# EAGLE design sismin_LC (EAGLE 7.6.0)
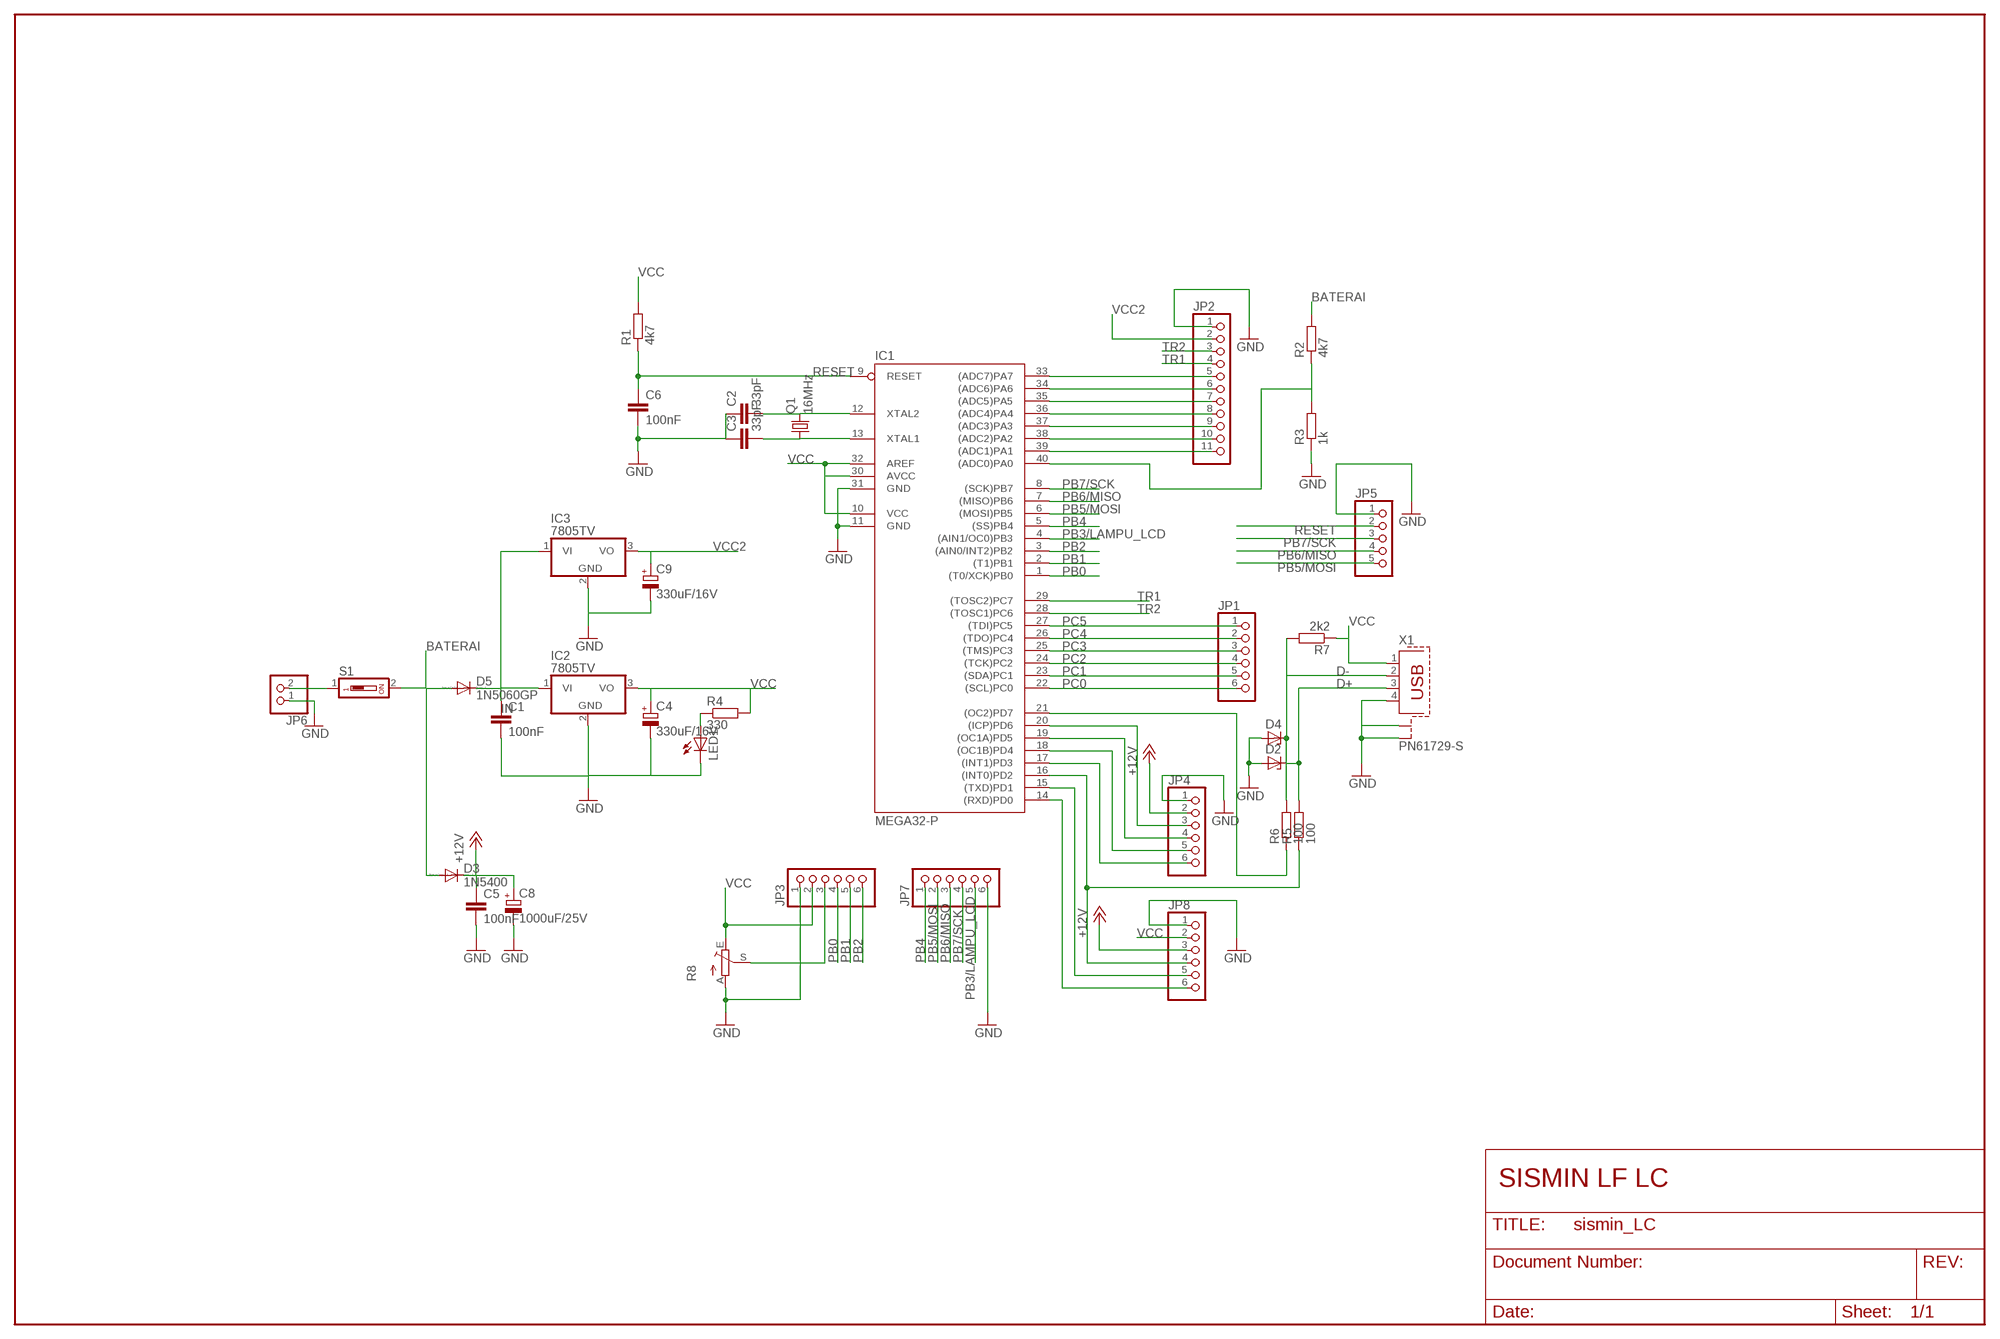
[diagram p0: schematic, sheet 1]

## Parts
C1  100nF  C-EU050-025X075  [C050-025X075]
C2  33pF  C-EU025-025X050  [C025-025X050]
C3  33pF  C-EU025-025X050  [C025-025X050]
C4  330uF/16V  CPOL-EUE2-5  [E2-5]
C5  100nF  C-EU050-025X075  [C050-025X075]
C6  100nF  C-EU050-025X075  [C050-025X075]
C8  1000uF/25V  CPOL-EUE2.5-6  [E2,5-6]
C9  330uF/16V  CPOL-EUE2-5  [E2-5]
D2  ZENER-DIODEDO41Z10  [DO41Z10]
D3  1N5400  [DO201-15]
D4  ZENER-DIODEDO41Z10  [DO41Z10]
D5  1N5060GP  [DO15-12]
IC1  MEGA32-P  [DIL40]
IC2  7805TV  [TO220V]
IC3  7805TV  [TO220V]
JP1  PINHD-1X6  [1X06]
JP2  PINHD-1X11  [1X11]
JP3  PINHD-1X6  [1X06]
JP4  PINHD-1X6  [1X06]
JP5  PINHD-1X5  [1X05]
JP6  PINHD-1X2  [1X02]
JP7  PINHD-1X6  [1X06]
JP8  PINHD-1X6  [1X06]
LED1  LED3MM  [LED3MM]
Q1  16MHz  CRYSTALHC49S  [HC49/S]
R1  4k7  R-EU_0204/7  [0204/7]
R2  4k7  R-EU_0204/7  [0204/7]
R3  1k  R-EU_0204/7  [0204/7]
R4  330  R-EU_0204/7  [0204/7]
R5  100  R-EU_0204/7  [0204/7]
R6  100  R-EU_0204/7  [0204/7]
R7  2k2  R-EU_0204/7  [0204/7]
R8  TRIM_EU-RS3  [RS3]
S1  DS01  [DS-01]
X1  PN61729-S  [PN61729-S]

## Nets
+12V: C5.1 C8.+ D3.C JP4.2 JP8.3
ADC1: IC1.39((ADC1)PA1) JP2.11
ADC2: IC1.38((ADC2)PA2) JP2.10
ADC3: IC1.37((ADC3)PA3) JP2.9
ADC4: IC1.36((ADC4)PA4) JP2.8
ADC5: IC1.35((ADC5)PA5) JP2.7
ADC6: IC1.34((ADC6)PA6) JP2.6
ADC7: IC1.33((ADC7)PA7) JP2.5
BATERAI: D3.A D5.A R2.2 S1.2
D+: D2.C R5.2 X1.3
D-: D4.C R6.2 R7.2 X1.2
GND: C1.2 C2.1 C3.1 C4.- C5.2 C6.2 C8.- C9.- D2.A D4.A IC1.11(GND) IC1.31(GND) IC2.2(GND) IC3.2(GND) JP2.1 JP3.1 JP4.1 JP5.1 JP6.1 JP7.6 JP8.1 LED1.K(C) R3.1 R8.A X1.4 X1.S1 X1.S2
IN: C1.1 D5.C IC2.1(VI) IC3.1(VI)
N$4: C2.2 IC1.12(XTAL2) Q1.2
N$5: C3.2 IC1.13(XTAL1) Q1.1
N$12: IC1.40((ADC0)PA0) R2.1 R3.2
N$13: JP6.2 S1.1
N$20: LED1.A R4.1
N$22: IC1.16((INT0)PD2) JP8.4 R5.1
N$23: IC1.20((ICP)PD6) JP4.3
N$24: IC1.19((OC1A)PD5) JP4.4
N$25: IC1.18((OC1B)PD4) JP4.5
N$26: IC1.17((INT1)PD3) JP4.6
N$32: JP3.3 R8.S
N$40: IC1.21((OC2)PD7) R6.1
PB0: IC1.1((T0/XCK)PB0) JP3.4
PB1: IC1.2((T1)PB1) JP3.5
PB2: IC1.3((AIN0/INT2)PB2) JP3.6
PB3/LAMPU_LCD: IC1.4((AIN1/OC0)PB3) JP7.5
PB4: IC1.5((SS)PB4) JP7.1
PB5/MOSI: IC1.6((MOSI)PB5) JP5.5 JP7.2
PB6/MISO: IC1.7((MISO)PB6) JP5.4 JP7.3
PB7/SCK: IC1.8((SCK)PB7) JP5.3 JP7.4
PC0: IC1.22((SCL)PC0) JP1.6
PC1: IC1.23((SDA)PC1) JP1.5
PC2: IC1.24((TCK)PC2) JP1.4
PC3: IC1.25((TMS)PC3) JP1.3
PC4: IC1.26((TDO)PC4) JP1.2
PC5: IC1.27((TDI)PC5) JP1.1
RESET: C6.1 IC1.9(RESET) JP5.2 R1.1
RX: IC1.14((RXD)PD0) JP8.6
TR1: IC1.29((TOSC2)PC7) JP2.4
TR2: IC1.28((TOSC1)PC6) JP2.3
TX: IC1.15((TXD)PD1) JP8.5
VCC: C4.+ IC1.10(VCC) IC1.30(AVCC) IC1.32(AREF) IC2.3(VO) JP3.2 JP8.2 R1.2 R4.2 R7.1 R8.E X1.1
VCC2: C9.+ IC3.3(VO) JP2.2

## Notes on the sheet
- SISMIN LF LC

## Library data of the parts
C1-C3 C5 C6 = resistor:C-EU: CAPACITOR, European symbol
C4 C8 C9 = resistor:CPOL-EU: POLARIZED CAPACITOR, European symbol
D2 D4 = diode:ZENER-DIODE: Z-Diode
D3 = diode:1N5400: DIODE standard rectifier, 3 A, 50 V (Motorola)
D5 = diode:1N5060GP: DIODE controlled avalanche rectifier
IC1 = atmel:MEGA32-P: MICROCONTROLLER 32 Kbytes FLASH 2 Kbytes SRAM 1 Kbytes EEPROM USART 8-channel 10 bit ADC Source: www.atmel.com .. doc2503.pdf; MPN: ATMEGA32-16PU; OC_FARNELL: 1661729; OC_NEWARK: 51P1794
IC2 IC3 = linear:78*: Positive VOLTAGE REGULATOR Source: http://cache.national.com/ds/LM/LM78L05.pdf http://www.fairchildsemi.com/ds/LM/LM7805.pdf
JP1 JP3 JP4 JP7 JP8 = pinhead:PINHD-1X6: PIN HEADER
JP2 = pinhead:PINHD-1X11: PIN HEADER
JP5 = pinhead:PINHD-1X5: PIN HEADER
JP6 = pinhead:PINHD-1X2: PIN HEADER
LED1 = led:LED: LED OSRAM: - CHIPLED LG R971, LG N971, LY N971, LG Q971, LY Q971, LO R971, LY R971 LH N974, LH R974 LS Q976, LO Q976, LY Q976 LO Q996 - Hyper CHIPLED LW Q18S LB Q993, LB Q99A, LB R99A - SideLED LS A670, LO A670, LY A670, LG A670, LP A670 LB A673, LV A673, LT A673, LW A673 LH A674 LY A675 LS A676, LA A676, LO A676, LY A676, LW A676 LS A679, LY A679, LG A679 - Hyper Micro SIDELED® LS Y876, LA Y876, LO Y876, LY Y876 LT Y87S - SmartLED LW L88C, LW L88S LB L89C, LB L89S, LG L890 LS L89K, LO L89K, LY L89K LS L896, LA L896, LO L896, LY L896 - TOPLED LS T670, LO T670, LY T670, LG T670, LP T670 LSG T670, LSP T670, LSY T670, LOP T670, LYG T670 LG T671, LOG T671, LSG T671 LB T673, LV T673, LT T673, LW T673 LH T674 LS T676, LA T676, LO T676, LY T676, LB T676, LH T676, LSB T676, LW T676 LB T67C, LV T67C, LT T67C, LS T67K, LO T67K, LY T67K, LW E67C LS E67B, LA E67B, LO E67B, LY E67B, LB E67C, LV E67C, LT E67C LW T67C LS T679, LY T679, LG T679 LS T770, LO T770, LY T770, LG T770, LP T770 LB T773, LV T773, LT T773, LW T773 LH T774 LS E675, LA E675, LY E675, LS T675 LS T776, LA T776, LO T776, LY T776, LB T776 LHGB T686 LT T68C, LB T68C - Hyper Mini TOPLED® LB M676 - Mini TOPLED Santana® LG M470 LS M47K, LO M47K, LY M47K Source: http://www.osram.convergy.de LUXEON: - LUMILED® LXK2-PW12-R00, LXK2-PW12-S00, LXK2-PW14-U00, LXK2-PW14-V00 LXK2-PM12-R00, LXK2-PM12-S00, LXK2-PM14-U00 LXK2-PE12-Q00, LXK2-PE12-R00, LXK2-PE12-S00, LXK2-PE14-T00, LXK2-PE14-U00 LXK2-PB12-K00, LXK2-PB12-L00, LXK2-PB12-M00, LXK2-PB14-N00, LXK2-PB14-P00, LXK2-PB14-Q00 LXK2-PR12-L00, LXK2-PR12-M00, LXK2-PR14-Q00, LXK2-PR14-R00 LXK2-PD12-Q00, LXK2-PD12-R00, LXK2-PD12-S00 LXK2-PH12-R00, LXK2-PH12-S00 LXK2-PL12-P00, LXK2-PL12-Q00, LXK2-PL12-R00 Source: www.luxeon.com KINGBRIGHT: KA-3528ASYC Source: www.kingbright.com
Q1 = crystal:CRYSTAL: CRYSTAL; OC_FARNELL: 1667008; OC_NEWARK: unknown
R1-R7 = resistor:R-EU_: RESISTOR, European symbol
R8 = pot:TRIM_EU-: POTENTIOMETER
S1 = switch-dil:DS01: DIL/CODE SWITCH; OC_FARNELL: unknown; OC_NEWARK: unknown
X1 = con-berg:PN61729-S: BERG USB connector; OC_FARNELL: unknown; OC_NEWARK: unknown

## Board
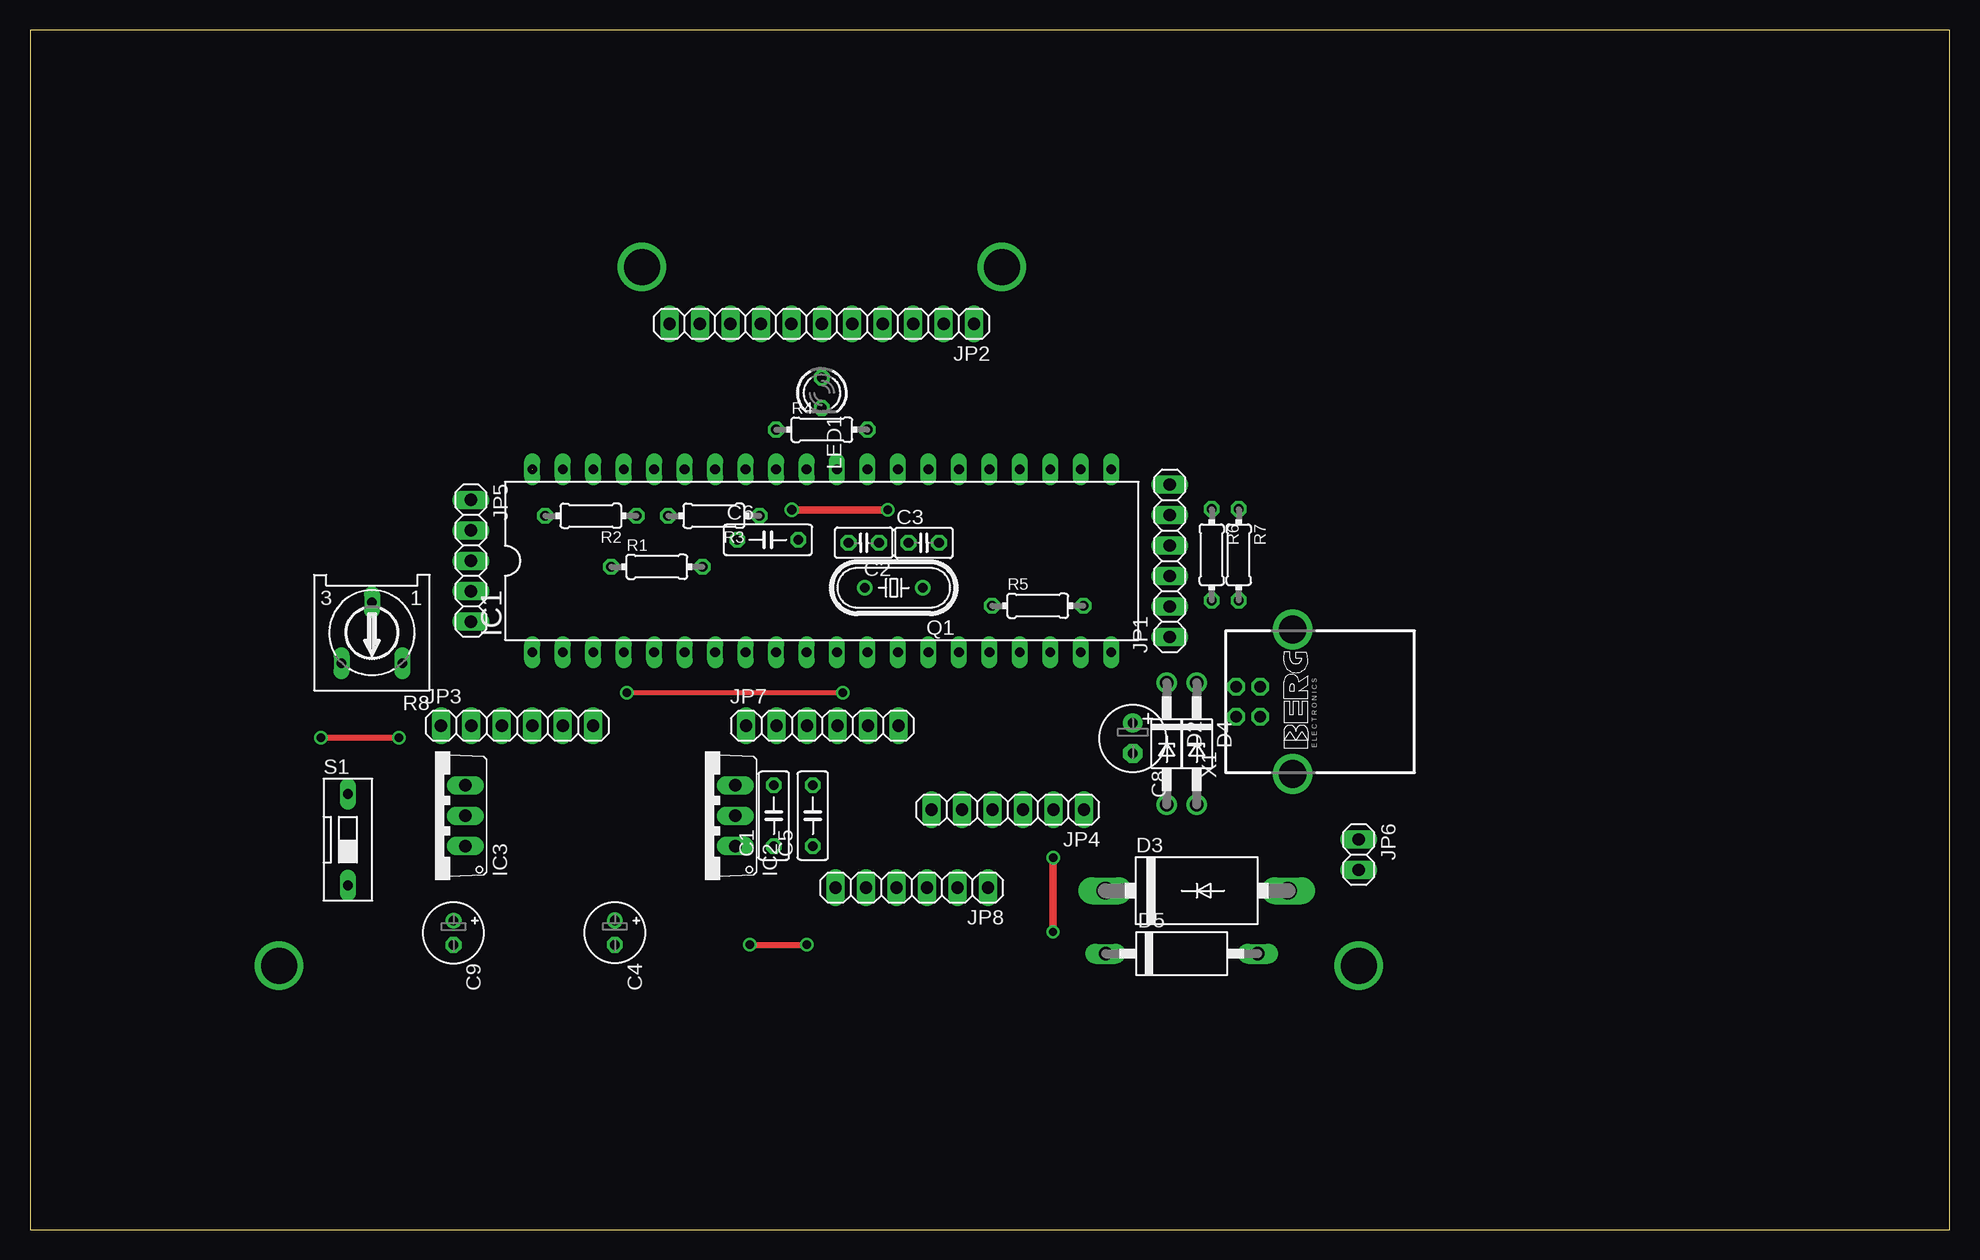
[diagram p1: board, top side]
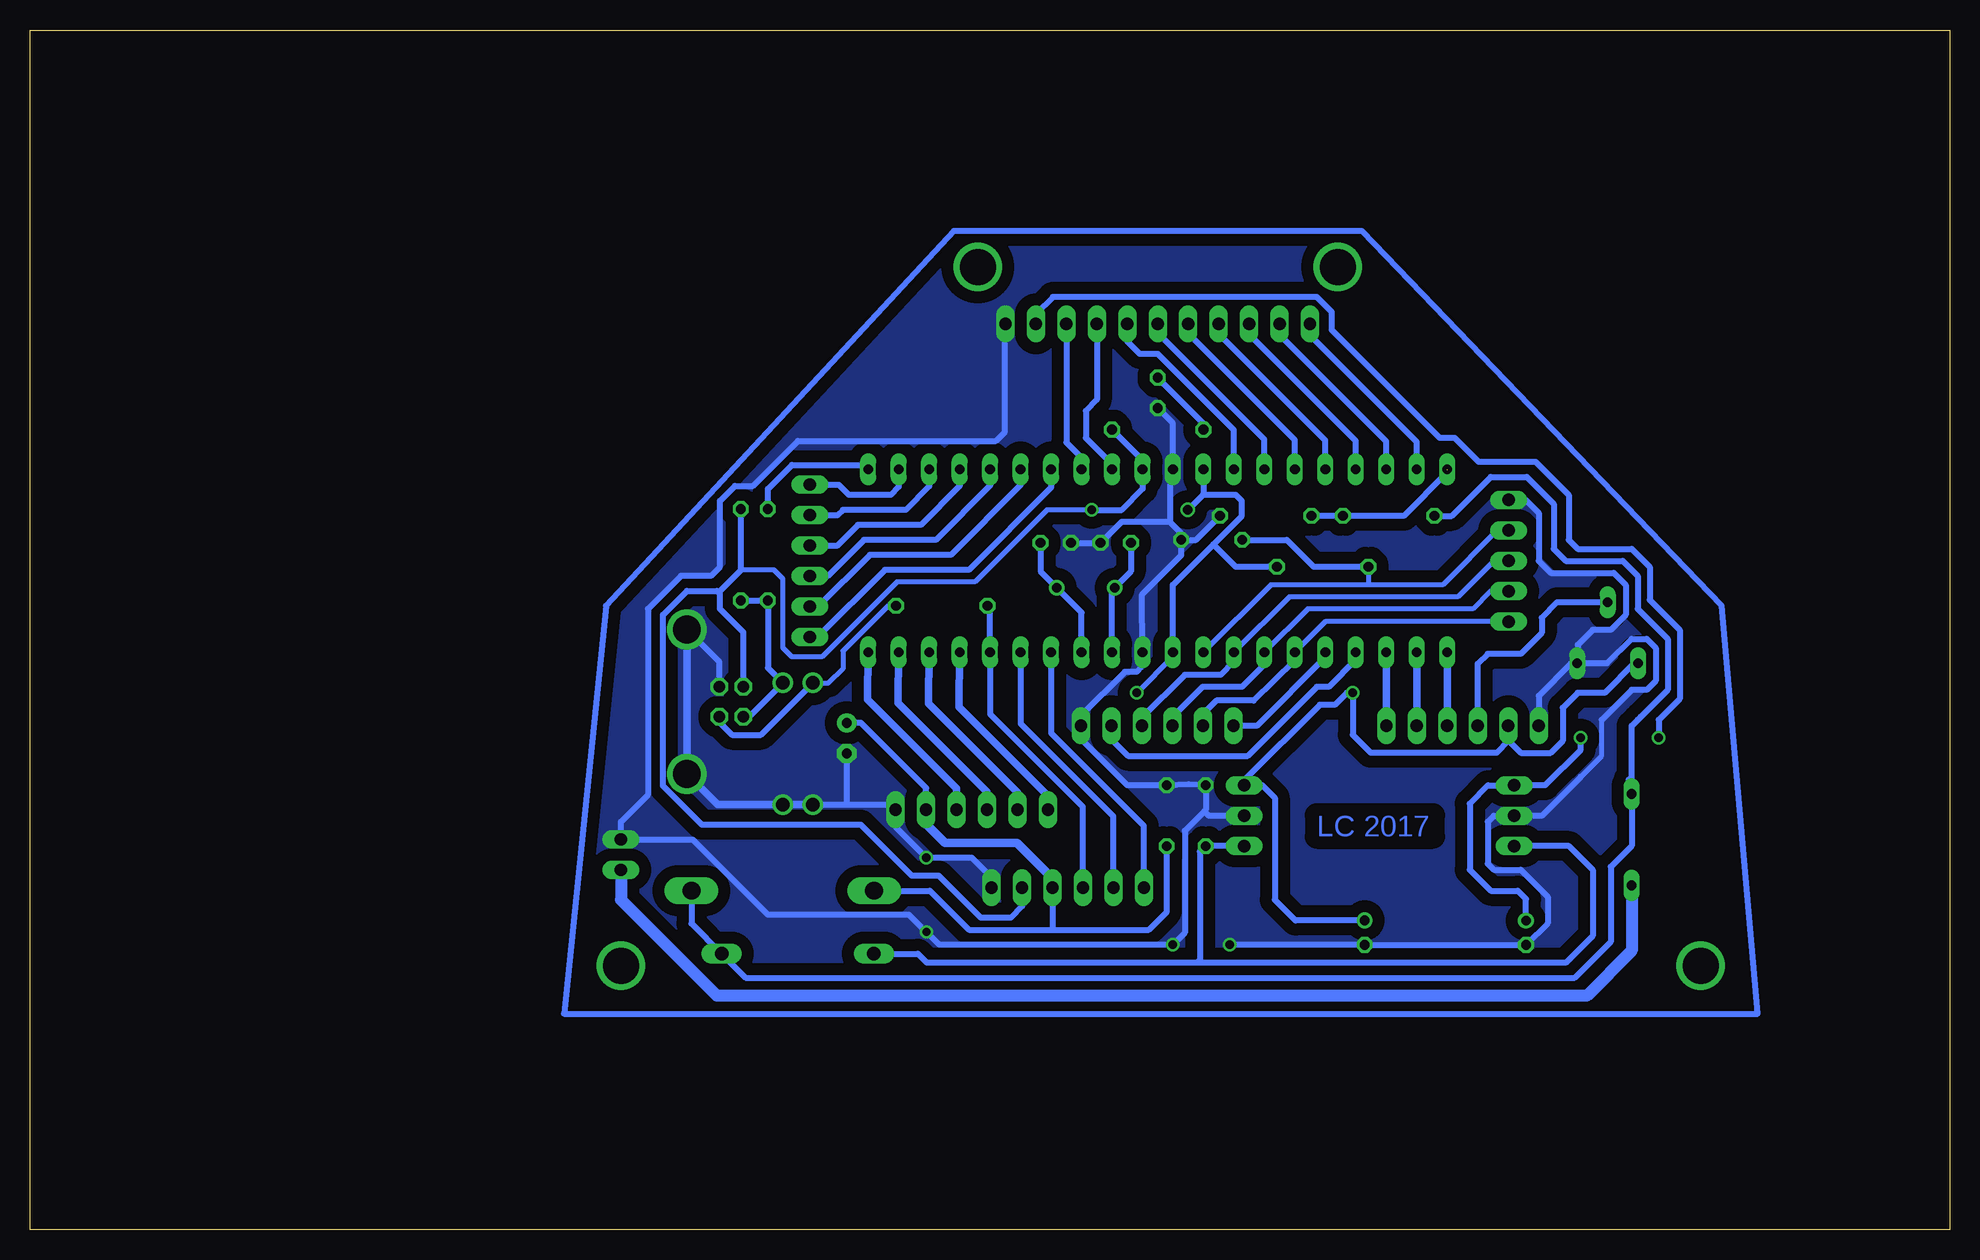
[diagram p2: board, bottom side, seen from below]

Size 160 x 100 mm. Coordinates in mm from the lower left corner, seen from the top.
Outline: 0,0 160,0 160,100 0,100 0,0
Copper layers (1*16): Top 0.035mm / dielectric 1.5mm / Bottom 0.035mm
Design rules "default": minimum track width 10mil, minimum drill 24mil, track to track 8mil, track to pad 8mil, pad to pad 8mil, via to via 8mil, smd to smd 8mil, copper to edge 40mil, drill to drill 8mil, minimum pad ring 10mil, minimum via ring 8mil, stop-mask expansion 4mil, vias tented up to drill 0mil, thermal gap 10mil

### Footprints (pad centres in the part's own frame; a part is rotated, then mirrored left to right if it is on the bottom)
C050-025X075 = drill 0.813 octagon: 1 -2.54,0; 2 2.54,0
C025-025X050 = drill 0.813 octagon: 1 -1.27,0; 2 1.27,0
E2-5 = drill 0.813 pad 1.27: + -1.016,0 | drill 0.813 pad 1.27 octagon: - 1.016,0
E2,5-6 = drill 0.813 pad 1.6: + -1.27,0 | drill 0.813 pad 1.6 octagon: - 1.27,0
DO41Z10 = drill 1.118: A 5.08,0; C -5.08,0
DO201-15 = drill 1.499 long: A 7.62,0; C -7.62,0
DO15-12 = drill 1.118 long: A 6.35,0; C -6.35,0
DIL40 = drill 0.813 long: 1 -24.13,-7.62; 2 -21.59,-7.62; 3 -19.05,-7.62; 4 -16.51,-7.62; 5 -13.97,-7.62; 6 -11.43,-7.62; 7 -8.89,-7.62; 8 -6.35,-7.62; 9 -3.81,-7.62; 10 -1.27,-7.62; 11 1.27,-7.62; 12 3.81,-7.62; 13 6.35,-7.62; 14 8.89,-7.62; 15 11.43,-7.62; 16 13.97,-7.62; 17 16.51,-7.62; 18 19.05,-7.62; 19 21.59,-7.62; 20 24.13,-7.62; 21 24.13,7.62; 22 21.59,7.62; 23 19.05,7.62; 24 16.51,7.62; 25 13.97,7.62; 26 11.43,7.62; 27 8.89,7.62; 28 6.35,7.62; 29 3.81,7.62; 30 1.27,7.62; 31 -1.27,7.62; 32 -3.81,7.62; 33 -6.35,7.62; 34 -8.89,7.62; 35 -11.43,7.62; 36 -13.97,7.62; 37 -16.51,7.62; 38 -19.05,7.62; 39 -21.59,7.62; 40 -24.13,7.62
TO220V = drill 1.016 long: 1 -2.54,-2.54; 2 0,-2.54; 3 2.54,-2.54
1X06 = drill 1.016 long: 1 -6.35,0; 2 -3.81,0; 3 -1.27,0; 4 1.27,0; 5 3.81,0; 6 6.35,0
1X11 = drill 1.016 long: 1 -12.7,0; 2 -10.16,0; 3 -7.62,0; 4 -5.08,0; 5 -2.54,0; 6 0,0; 7 2.54,0; 8 5.08,0; 9 7.62,0; 10 10.16,0; 11 12.7,0
1X05 = drill 1.016 long: 1 -5.08,0; 2 -2.54,0; 3 0,0; 4 2.54,0; 5 5.08,0
1X02 = drill 1.016 long: 1 -1.27,0; 2 1.27,0
LED3MM = drill 0.813 octagon: A -1.27,0; K 1.27,0
HC49/S = drill 0.813: 1 -2.413,0; 2 2.413,0
0204/7 = drill 0.813 octagon: 1 -3.81,0; 2 3.81,0
RS3 = drill 0.813 long: A -2.54,2.54; E 2.54,2.54; S 0,-2.54
DS-01 = drill 0.813 long: 1 0,-3.81; 2 0,3.81
PN61729-S = drill 0.95 octagon: 1 1.25,4.71; 2 -1.25,4.71; 3 -1.25,2.71; 4 1.25,2.71 | drill 2.3 pad 2.9: S1 -6.02,0; S2 6.02,0

### Placement (x,y rotation side)
C1  62,34.5 90 top
C2  69.5,57.25 180 top
C3  74.5,57.25 0 top
C4  48.75,24.75 270 top
C5  65.25,34.5 90 top
C6  61.5,57.5 0 top
C8  91.92,40.95 270 top
C9  35.3,24.74 270 top
D2  94.75,40.5 270 top
D3  97.25,28.25 0 top
D4  97.25,40.5 270 top
D5  96,23 0 top
IC1  66,55.75 0 top
IC2  56.25,34.5 90 top
IC3  33.75,34.5 90 top
JP1  95,55.75 90 top
JP2  66,75.5 180 top
JP3  40.6,42 0 top
JP4  81.5,35 180 top
JP5  36.75,55.75 270 top
JP6  110.75,31.25 270 top
JP7  66.04,42 0 top
JP8  73.5,28.5 180 top
LED1  66,69.75 270 top
Q1  72,53.5 180 top
R1  52.25,55.25 0 top
R2  46.75,59.5 180 top
R3  57,59.5 180 top
R4  66,66.68 0 top
R5  84,52 0 top
R6  98.5,56.25 270 top
R7  100.75,56.25 270 top
R8  28.5,49.75 180 top
S1  26.5,32.5 0 top
X1  105.25,44 90 top

### Tracks (layer width: path | path; a pad name or v marks a point on that pad's centre or on a via)
+12V
  Bottom 0.5: 74.75,28.48 JP8.3 74.77,25.02 74.75,25 | JP4.2 85.31,36.81 90.75,42.25 91.89,42.25 C8.+ | 74.75,25 81.75,25 85,28.25 D3.C | 74.75,25 66.75,25 65.25,26.5 C5.1
  Bottom 0.7: 85.31,33.81 83.75,32.25 77.75,32.25 74.75,29.25 74.75,28.52 JP8.3
  Bottom 0.813: JP4.2 85.31,33.81
ADC1
  Bottom 0.5: IC1.39 44.41,65.66 53.3,74.55 JP2.11
ADC2
  Bottom 0.5: IC1.38 46.95,65.7 55.84,74.59 JP2.10
ADC3
  Bottom 0.5: IC1.37 49.49,65.74 58.38,74.63 JP2.9
ADC4
  Bottom 0.5: IC1.36 52.03,65.78 60.92,74.67 JP2.8
ADC5
  Bottom 0.5: IC1.35 54.57,65.82 63.5,74.75 63.5,75.46 JP2.7
ADC6
  Bottom 0.5: IC1.34 57.11,65.86 66,74.75 JP2.6
ADC7
  Bottom 0.5: IC1.33 59.65,66.65 66,73 67.5,73 67.88,73.38 68.25,73.75 68.54,74.04 JP2.5
BATERAI
  Bottom 0.5: 26.5,37.75 26.75,37.5 26.75,36.56 S1.2 | D3.A 104.87,25.52 D5.A 100.35,21 31.25,21 28.25,24 28.25,30.25 26.5,32 S1.2 | R2.2 41.5,59.5 38.25,62.75 35.25,62.75 33,60.5 33,56.75 32,55.75 27.25,55.75 26,54.5 26,51.75 23.5,49.25 23.5,45 25.75,42.75 26,42.5 26.5,42 S1.2
D+
  Bottom 0.406: R5.2 88.5,52 92.25,48.25 92.25,46.75 93.42,45.58 D2.C
  Bottom 0.5: X1.3 102.54,42.29 101.5,41.25 99.08,41.25 D2.C
D-
  Bottom 0.5: X1.2 100.08,42.75 D4.C 98.5,46.83 R6.2 R7.2
GND  (via drill 0.7)
  Top 0.5: v60,23.75 v64.75,23.75
  Top 0.61: v85.27,24.81 85.27,30.99 v85.28,31
  Bottom 0.406: 30.75,37.75 29,39.5 29,42.5
  Bottom 0.5: IC1.11 67.31,52.94 64.04,56.21 C6.2 | JP8.1 79.85,29.35 81.5,31 v85.28,31 | v85.28,31 | v85.28,31 87.85,33.57 JP4.1 88.27,35.42 91.75,35.42 | 65,59 65,62.75 64.73,63.02 IC1.31 64.73,67.21 LED1.K | C6.2 64.04,58.04 65,59 | C3.1 C2.1 69.02,59 65,59 | R8.A 31.54,47.21 34.25,44.5 JP3.1 | JP5.1 35.33,60.83 34.25,59.75 34.25,55.75 33.25,54.75 28,54.75 27,53.75 27,51.25 28.25,50 29.75,50 31,48.75 31,47.25 R8.A | 30.75,37.75 34,34.5 IC3.2 38,34.5 38.5,34 38.5,30.5 38,30 35.75,30 33.5,27.75 33.5,25.52 C9.- | 67.36,47.24 67.36,46.89 67.75,46.5 68.75,46.5 72.39,42.86 JP7.6 72.39,40.89 68.54,37.04 C5.2 63.42,37.12 C1.2 62,35 62.12,34.88 | 62.12,34.88 63.75,33.25 63.75,24.75 v64.75,23.75 84.21,23.75 85.22,24.77 85.27,24.77 v85.27,24.81 85.31,24.81 86.75,26.25 98.5,26.25 104.77,32.52 JP6.1 110.75,34 108.5,36.25 108.5,51.75 105.75,54.5 103.25,54.5 102.5,55.25 102.5,60.75 101.25,62 99.75,62 96,65.75 79.5,65.75 78.75,66.5 78.75,75.45 JP2.1 | D2.A 91.75,35.42 | 62.12,34.88 61.75,34.5 IC2.2 | C8.- 91.92,35.59 91.75,35.42 | v60,23.75 59.98,23.73 C4.- 35.31,23.73 C9.- | 35.27,23.75 C9.- | X1.4 102.54,47.31 X1.S2 | C6.2 62.81,57.5 R3.1 | R8.A 28.54,47.21 26.5,49.25 25.25,49.25 24.5,48.5 24.5,45.75 25.25,45 26.5,45 29,42.5
  Bottom 0.61: IC1.11 67.36,48.21 67.36,47.24 | X1.S2 X1.S1 102.69,35.42 D4.A D2.A
  pour Bottom (isolate 1, no thermals): 49,83.25 83,83.25 112,52 115.5,18 16,18 19,52
IN
  Bottom 0.5: D5.C 86,23 85.25,22.25 62.75,22.25 | 62.75,22.25 32,22.25 29.75,24.5 29.75,30 31.71,31.96 IC3.1 | 62.75,22.25 62.5,22.5 62.5,31.5 62.04,31.96 C1.1 IC2.1
N$1  (via drill 3 pad 2.54)
  other vias: 51,80.25
N$2  (via drill 3 pad 2.54)
  other vias: 81,80.25
N$3  (via drill 3 pad 2.54)
  other vias: 20.75,22
N$4
  Bottom 0.5: IC1.12 69.81,53.28 Q1.2 68.23,54.86 C2.2
N$5
  Bottom 0.5: IC1.13 72.35,51.44 Q1.1 75.77,54.86 C3.2
N$6  (via drill 3 pad 2.54)
  other vias: 110.75,22
N$12  (1 unrouted)
  Bottom 0.5: IC1.40 41.88,63.12 45.5,59.5 R2.1 R3.2
N$13
  Bottom 1.016: S1.1 26.5,23.23 26.52,23.23 30.25,19.5 102.75,19.5 110.75,27.5 JP6.2
N$20
  Bottom 0.5: LED1.A 66,71 62.25,67.25 62.25,66.74 R4.1
N$22
  Bottom 0.5: JP8.4 72.23,35.23 79.97,42.97 IC1.16 79.97,52.28 R5.1
N$23
  Bottom 0.61: IC1.20 90.17,44.17 82.77,36.77 JP4.3
N$24
  Bottom 0.61: IC1.19 87.63,43.88 80.23,36.48 JP4.4
N$25
  Bottom 0.61: IC1.18 85.09,43.84 77.69,36.44 JP4.5
N$26
  Bottom 0.61: IC1.17 82.55,43.55 75.15,36.15 JP4.6
N$32
  Bottom 0.5: R8.S 32.71,52.29 34,51 34,49.75 35.75,48 38.5,48 39.33,47.17 JP3.3
N$40
  Bottom 0.5: R6.1 98.5,61.75 96.5,63.75 90.51,63.75 IC1.21
N$43
  Bottom 0.5: 49,83.25 83,83.25 112,52 115.5,18 16,18 19,52 49,83.25
PB0
  Bottom 0.61: IC1.1 JP3.4
PB1
  Bottom 0.61: IC1.2 JP3.5
PB2
  Bottom 0.61: IC1.3 JP3.6
PB3/LAMPU_LCD
  Bottom 0.5: JP7.5 69.85,40.85 68.5,39.5 58.5,39.5 52.75,45.25 51.75,45.25 49.49,47.51 IC1.4
PB4
  Bottom 0.5: IC1.5 52.03,47.72 57.75,42 JP7.1
PB5/MOSI
  Bottom 0.406: JP5.5 52.03,50.67 IC1.6
  Bottom 0.5: IC1.6 54.62,47.45 58.01,44.09 61.12,44.09 62.23,42.98 JP7.2
PB6/MISO
  Bottom 0.406: JP5.4 38.29,53.21 39.75,51.75 53.49,51.75 IC1.7
  Bottom 0.5: IC1.7 57.15,47.04 58.96,45.23 62.27,45.23 64.77,42.73 JP7.3
PB7/SCK
  Bottom 0.406: JP5.3 38,55.75 41,52.75 55.03,52.75 IC1.8
  Bottom 0.5: IC1.8 59.69,47.31 60.75,46.25 63.75,46.25 67.31,42.69 JP7.4
PC0
  Bottom 0.5: IC1.22 87.59,61.91 88.25,61.25 91.75,61.25 92.6,62.1 JP1.6
PC1
  Bottom 0.5: IC1.23 85.05,61.95 87,60 92.25,60 92.69,59.56 JP1.5
PC2
  Bottom 0.5: IC1.24 82.51,61.99 85.75,58.75 91,58.75 92.75,57 94.98,57 JP1.4
PC3
  Bottom 0.5: IC1.25 79.97,62.03 84.5,57.5 90.5,57.5 93.5,54.5 94.98,54.5 JP1.3
PC4
  Bottom 0.5: IC1.26 77.43,62.07 83.25,56.25 90,56.25 94.31,51.94 JP1.2
PC5
  Bottom 0.5: IC1.27 74.89,61.86 81.75,55 88.75,55 94.35,49.4 JP1.1
RESET
  Bottom 0.406: JP5.2 37.71,58.29 42.25,53.75 48.5,53.75 | 48.5,53.75 56.57,53.75 IC1.9 | R1.1 48.44,53.81 48.5,53.75
  Bottom 0.5: C6.1 55.25,57.5 53,55.25 R1.1
RX
  Bottom 0.5: IC1.14 74.89,41.39 67.15,33.65 JP8.6
TR1
  Bottom 0.5: JP2.4 71.08,69.17 72,68.25 72,66 69.81,63.81 IC1.29
TR2
  Bottom 0.5: IC1.28 72.35,64.35 73.62,65.62 JP2.3
TX
  Bottom 0.5: IC1.15 77.43,42.18 71.62,36.38 70.75,35.5 69.69,34.44 JP8.5
VCC  (via drill 0.7, 0.8)
  Top 0.406: v67.75,44.75 v49.75,44.75
  Top 0.61: v63.5,60 v71.5,60
  Bottom 0.406: IC1.10 64.73,47.77 v67.75,44.75 | v71.5,60 75.25,60 81.25,54 87.75,54 94,47.75 96.5,47.75 97.25,48.5 97.25,54.25 98,55 100.75,55
  Bottom 0.5: 61.38,57.12 59,59.5 59,60.75 59.5,61.25 62.25,61.25 | 61.38,57.12 64.75,53.75 64.75,52.75 64.73,52.73 IC1.10 | 62.25,61.25 v63.5,60 | R8.E 26.29,47.21 28.75,44.75 31,44.75 32.25,43.5 32.25,40.75 33.25,39.75 35.75,39.75 36.71,40.71 36.79,40.71 | JP3.2 36.79,40.71 | IC1.32 62.19,61.31 62.25,61.25 | R4.2 67.27,64.14 IC1.30 67.27,61.73 69,60 v71.5,60 | R7.1 100.75,55 102.5,53.25 102.5,53 | 102.5,53 102.5,51.75 100.54,49.79 X1.1 | 102.5,53 102.75,53.25 105.25,53.25 107.25,51.25 107.25,37 104,33.75 90.75,33.75 86.5,29.5 84.25,29.5 80.75,26 78.25,26 77.31,26.94 77.31,27.19 | 36.79,40.71 37.75,39.75 48.25,39.75 49.75,41.25 v49.75,44.75 50.25,44.75 51.25,43.75 52.5,43.75 58.79,37.46 IC2.3 57.29,37.04 56.25,36 56.25,27.5 54.52,25.77 C4.+ | R1.2 59.5,55.25 61.38,57.12
  Bottom 0.61: JP8.2 77.31,27.19
VCC2  (via drill 0.7)
  Top 0.5: v30.75,41 v24.25,41
  Bottom 0.5: v30.75,41 30.75,40 33.71,37.04 IC3.3 38.46,37.04 40,35.5 40,30 38.25,28.25 36,28.25 35.3,27.55 C9.+ | JP2.2 76.16,76.34 74.75,77.75 52.75,77.75 51.5,76.5 51.5,75 42.5,66 41.25,66 39.25,64 34.5,64 31.75,61.25 31.75,57.5 31,56.75 26.5,56.75 25,55.25 25,52.5 22.5,50 22.5,44.25 24.25,42.5 v24.25,41

### Text on the board
Bottom: LC 2017